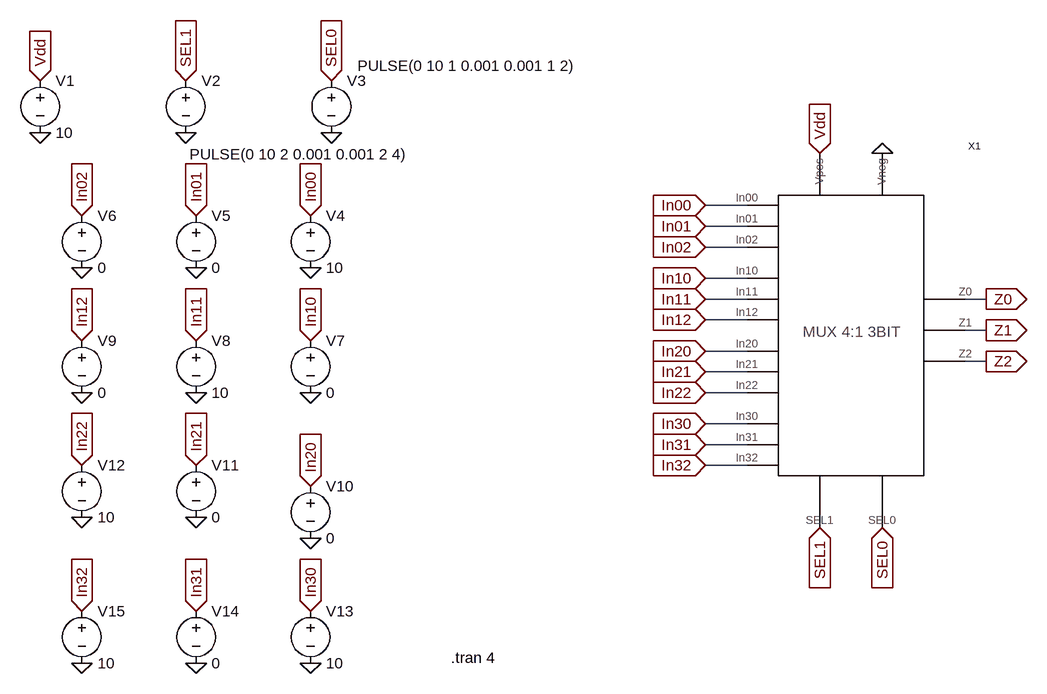
[diagram p0: schematic MUX3BIT_SYM_TESTING.asc]
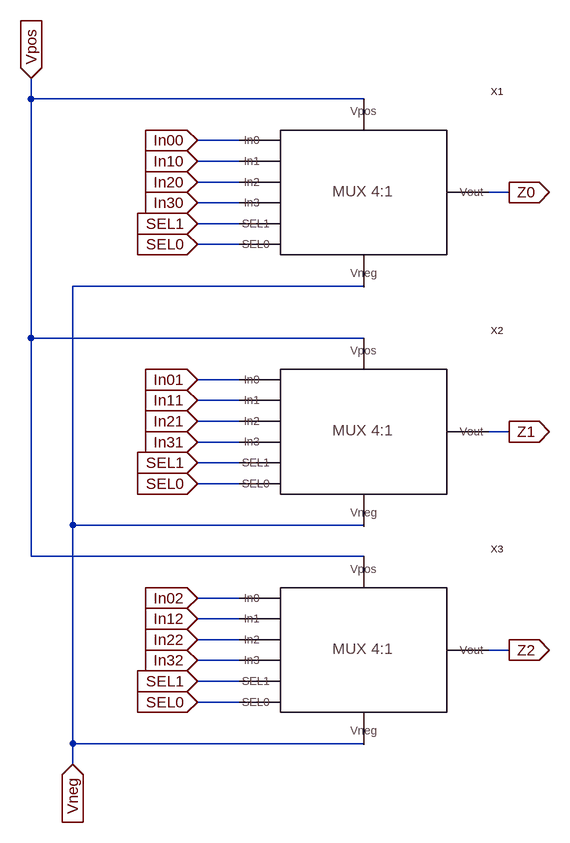
[diagram p1: sub-circuit mux3bit_sym.asc]
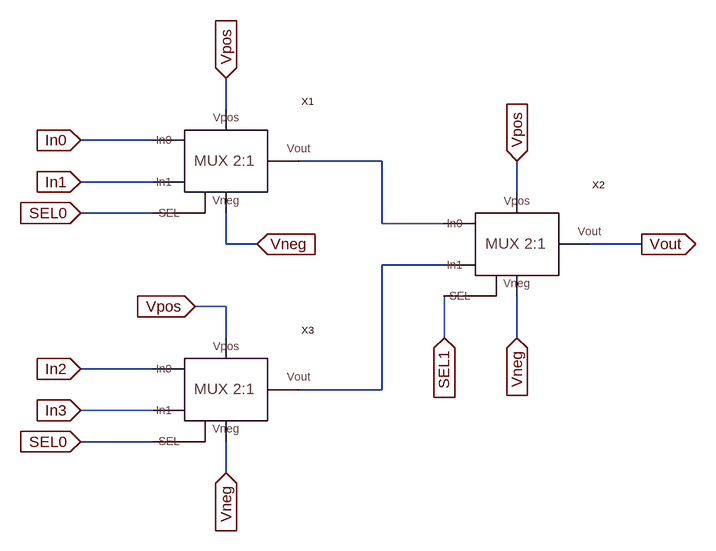
[diagram p2: sub-circuit mux4_1_sym.asc]
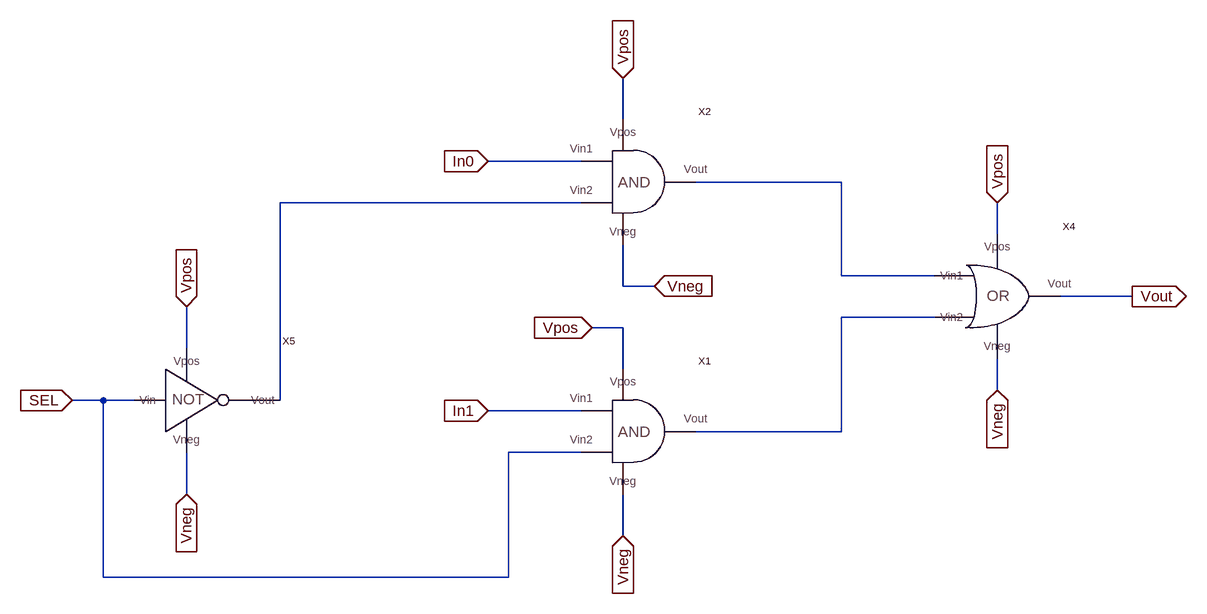
[diagram p3: sub-circuit mux2_1.asc]
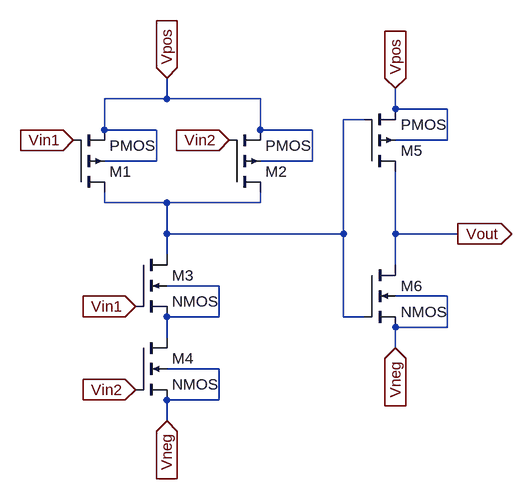
[diagram p4: sub-circuit and_sym.asc]
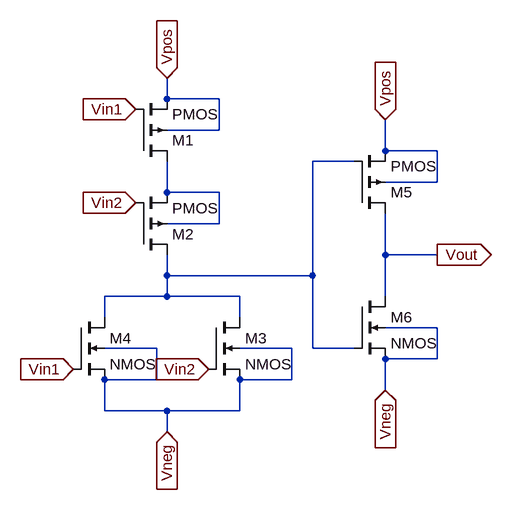
[diagram p5: sub-circuit or_sym.asc]
MUX3BIT_SYM_TESTING.asc, the LTspice schematic file:
Version 4
SHEET 1 1112 824
WIRE 656 64 592 64
WIRE 656 96 592 96
WIRE 656 128 592 128
WIRE 656 176 592 176
WIRE 656 208 592 208
WIRE 1024 208 992 208
WIRE 656 240 592 240
WIRE 1024 256 992 256
WIRE 656 288 592 288
WIRE 1024 304 992 304
WIRE 656 320 592 320
WIRE 656 352 592 352
WIRE 656 400 592 400
WIRE 656 432 592 432
WIRE 656 464 592 464
FLAG -432 -48 0
FLAG -208 -48 0
FLAG 16 -48 0
FLAG -16 160 0
FLAG -192 160 0
FLAG -368 160 0
FLAG -16 352 0
FLAG -192 352 0
FLAG -368 352 0
FLAG -16 576 0
FLAG -192 544 0
FLAG -368 544 0
FLAG -16 768 0
FLAG -192 768 0
FLAG -368 768 0
FLAG -432 -128 Vdd
IOPIN -432 -128 In
FLAG -208 -128 SEL1
IOPIN -208 -128 In
FLAG 16 -128 SEL0
IOPIN 16 -128 In
FLAG -16 80 In00
IOPIN -16 80 In
FLAG -192 80 In01
IOPIN -192 80 In
FLAG -368 80 In02
IOPIN -368 80 In
FLAG -16 272 In10
IOPIN -16 272 In
FLAG -192 272 In11
IOPIN -192 272 In
FLAG -368 272 In12
IOPIN -368 272 In
FLAG -16 496 In20
IOPIN -16 496 In
FLAG -192 464 In21
IOPIN -192 464 In
FLAG -368 464 In22
IOPIN -368 464 In
FLAG -16 688 In30
IOPIN -16 688 In
FLAG -192 688 In31
IOPIN -192 688 In
FLAG -368 688 In32
IOPIN -368 688 In
FLAG 768 -16 Vdd
IOPIN 768 -16 In
FLAG 864 -16 0
FLAG 768 560 SEL1
IOPIN 768 560 In
FLAG 864 560 SEL0
IOPIN 864 560 In
FLAG 592 64 In00
IOPIN 592 64 In
FLAG 592 96 In01
IOPIN 592 96 In
FLAG 592 128 In02
IOPIN 592 128 In
FLAG 592 176 In10
IOPIN 592 176 In
FLAG 592 208 In11
IOPIN 592 208 In
FLAG 592 240 In12
IOPIN 592 240 In
FLAG 592 288 In20
IOPIN 592 288 In
FLAG 592 320 In21
IOPIN 592 320 In
FLAG 592 352 In22
IOPIN 592 352 In
FLAG 592 400 In30
IOPIN 592 400 In
FLAG 592 432 In31
IOPIN 592 432 In
FLAG 592 464 In32
IOPIN 592 464 In
FLAG 1024 208 Z0
IOPIN 1024 208 Out
FLAG 1024 256 Z1
IOPIN 1024 256 Out
FLAG 1024 304 Z2
IOPIN 1024 304 Out
SYMBOL voltage -432 -144 R0
WINDOW 123 0 0 Left 0
WINDOW 39 0 0 Left 0
SYMATTR InstName V1
SYMATTR Value 10
SYMBOL voltage -208 -144 R0
WINDOW 3 6 129 Left 2
WINDOW 123 0 0 Left 0
WINDOW 39 0 0 Left 0
SYMATTR Value PULSE(0 10 2 0.001 0.001 2 4)
SYMATTR InstName V2
SYMBOL voltage -16 64 R0
WINDOW 123 0 0 Left 0
WINDOW 39 0 0 Left 0
SYMATTR InstName V4
SYMATTR Value 10
SYMBOL voltage -192 64 R0
WINDOW 123 0 0 Left 0
WINDOW 39 0 0 Left 0
SYMATTR InstName V5
SYMATTR Value 0
SYMBOL voltage -368 64 R0
WINDOW 123 0 0 Left 0
WINDOW 39 0 0 Left 0
SYMATTR InstName V6
SYMATTR Value 0
SYMBOL voltage -16 256 R0
WINDOW 123 0 0 Left 0
WINDOW 39 0 0 Left 0
SYMATTR InstName V7
SYMATTR Value 0
SYMBOL voltage -192 256 R0
WINDOW 123 0 0 Left 0
WINDOW 39 0 0 Left 0
SYMATTR InstName V8
SYMATTR Value 10
SYMBOL voltage -368 256 R0
WINDOW 123 0 0 Left 0
WINDOW 39 0 0 Left 0
SYMATTR InstName V9
SYMATTR Value 0
SYMBOL voltage -16 480 R0
WINDOW 123 0 0 Left 0
WINDOW 39 0 0 Left 0
SYMATTR InstName V10
SYMATTR Value 0
SYMBOL voltage -192 448 R0
WINDOW 123 0 0 Left 0
WINDOW 39 0 0 Left 0
SYMATTR InstName V11
SYMATTR Value 0
SYMBOL voltage -368 448 R0
WINDOW 123 0 0 Left 0
WINDOW 39 0 0 Left 0
SYMATTR InstName V12
SYMATTR Value 10
SYMBOL voltage -16 672 R0
WINDOW 123 0 0 Left 0
WINDOW 39 0 0 Left 0
SYMATTR InstName V13
SYMATTR Value 10
SYMBOL voltage -192 672 R0
WINDOW 123 0 0 Left 0
WINDOW 39 0 0 Left 0
SYMATTR InstName V14
SYMATTR Value 0
SYMBOL voltage -368 672 R0
WINDOW 123 0 0 Left 0
WINDOW 39 0 0 Left 0
SYMATTR InstName V15
SYMATTR Value 10
SYMBOL MUX3BIT_SYM 816 176 R0
SYMATTR InstName X1
SYMBOL voltage 16 -144 R0
WINDOW 3 40 -7 Left 2
WINDOW 123 0 0 Left 0
WINDOW 39 0 0 Left 0
SYMATTR Value PULSE(0 10 1 0.001 0.001 1 2)
SYMATTR InstName V3
TEXT 200 760 Left 2 !.tran 4

mux3bit_sym.asc, the sub-circuit schematic file:
Version 4
SHEET 1 880 1012
WIRE -256 -128 -256 -160
WIRE 256 -128 -256 -128
WIRE 64 -64 0 -64
WIRE 64 -32 0 -32
WIRE 64 0 0 0
WIRE 480 16 448 16
WIRE 64 32 0 32
WIRE 64 64 0 64
WIRE 64 96 0 96
WIRE 256 160 -192 160
WIRE -256 240 -256 -128
WIRE 256 240 -256 240
WIRE 64 304 0 304
WIRE 64 336 0 336
WIRE 64 368 0 368
WIRE 480 384 448 384
WIRE 64 400 0 400
WIRE 64 432 0 432
WIRE 64 464 0 464
WIRE -192 528 -192 160
WIRE 256 528 -192 528
WIRE -256 576 -256 240
WIRE 256 576 -256 576
WIRE 64 640 0 640
WIRE 64 672 0 672
WIRE 64 704 0 704
WIRE 480 720 448 720
WIRE 64 736 0 736
WIRE 64 768 0 768
WIRE 64 800 0 800
WIRE -192 864 -192 528
WIRE 256 864 -192 864
WIRE -192 896 -192 864
FLAG 0 -64 In00
IOPIN 0 -64 In
FLAG 0 -32 In10
IOPIN 0 -32 In
FLAG 0 0 In20
IOPIN 0 0 In
FLAG 0 32 In30
IOPIN 0 32 In
FLAG 0 64 SEL1
IOPIN 0 64 In
FLAG 0 96 SEL0
IOPIN 0 96 In
FLAG 0 304 In01
IOPIN 0 304 In
FLAG 0 336 In11
IOPIN 0 336 In
FLAG 0 368 In21
IOPIN 0 368 In
FLAG 0 400 In31
IOPIN 0 400 In
FLAG 0 432 SEL1
IOPIN 0 432 In
FLAG 0 464 SEL0
IOPIN 0 464 In
FLAG 0 640 In02
IOPIN 0 640 In
FLAG 0 672 In12
IOPIN 0 672 In
FLAG 0 704 In22
IOPIN 0 704 In
FLAG 0 736 In32
IOPIN 0 736 In
FLAG 0 768 SEL1
IOPIN 0 768 In
FLAG 0 800 SEL0
IOPIN 0 800 In
FLAG -256 -160 Vpos
IOPIN -256 -160 In
FLAG 480 16 Z0
IOPIN 480 16 Out
FLAG 480 384 Z1
IOPIN 480 384 Out
FLAG 480 720 Z2
IOPIN 480 720 Out
FLAG -192 896 Vneg
IOPIN -192 896 In
SYMBOL MUX4_1_SYM 256 16 R0
SYMATTR InstName X1
SYMBOL MUX4_1_SYM 256 384 R0
SYMATTR InstName X2
SYMBOL MUX4_1_SYM 256 720 R0
SYMATTR InstName X3

mux4_1_sym.asc, the sub-circuit schematic file:
Version 4
SHEET 1 880 680
WIRE 16 -112 16 -160
WIRE -96 -64 -208 -64
WIRE 256 -32 128 -32
WIRE -96 0 -208 0
WIRE 464 16 464 -32
WIRE -96 48 -208 48
WIRE 256 64 256 -32
WIRE 352 64 256 64
WIRE 16 96 16 48
WIRE 64 96 16 96
WIRE 656 96 576 96
WIRE 352 128 256 128
WIRE 16 192 -32 192
WIRE 16 240 16 192
WIRE 352 240 352 176
WIRE 464 240 464 176
WIRE -96 288 -208 288
WIRE 256 320 256 128
WIRE 256 320 128 320
WIRE -96 352 -208 352
WIRE -96 400 -208 400
WIRE 16 448 16 400
FLAG 16 -160 Vpos
IOPIN 16 -160 In
FLAG -32 192 Vpos
IOPIN -32 192 In
FLAG 464 -32 Vpos
IOPIN 464 -32 In
FLAG -208 -64 In0
IOPIN -208 -64 In
FLAG -208 0 In1
IOPIN -208 0 In
FLAG -208 288 In2
IOPIN -208 288 In
FLAG -208 352 In3
IOPIN -208 352 In
FLAG 352 240 SEL1
IOPIN 352 240 In
FLAG -208 48 SEL0
IOPIN -208 48 In
FLAG 656 96 Vout
IOPIN 656 96 Out
FLAG -208 400 SEL0
IOPIN -208 400 In
FLAG 464 240 Vneg
IOPIN 464 240 In
FLAG 16 448 Vneg
IOPIN 16 448 In
FLAG 64 96 Vneg
IOPIN 64 96 In
SYMBOL MUX2_1 16 -32 R0
SYMATTR InstName X1
SYMBOL MUX2_1 464 96 R0
SYMATTR InstName X2
SYMBOL MUX2_1 16 320 R0
SYMATTR InstName X3

mux2_1.asc, the sub-circuit schematic file:
Version 4
SHEET 1 1072 680
WIRE 176 -352 176 -416
WIRE 112 -288 -32 -288
WIRE 512 -256 288 -256
WIRE 112 -224 -352 -224
WIRE 752 -176 752 -224
WIRE 512 -112 512 -256
WIRE 656 -112 512 -112
WIRE 176 -96 176 -160
WIRE 224 -96 176 -96
WIRE 960 -80 848 -80
WIRE 656 -48 512 -48
WIRE 176 -32 128 -32
WIRE -496 0 -496 -64
WIRE 176 32 176 -32
WIRE 752 64 752 16
WIRE -624 80 -672 80
WIRE -576 80 -624 80
WIRE -352 80 -352 -224
WIRE 112 96 -32 96
WIRE 512 128 512 -48
WIRE 512 128 288 128
WIRE 112 160 0 160
WIRE -496 224 -496 160
WIRE 176 288 176 224
WIRE -624 352 -624 80
WIRE 0 352 0 160
WIRE 0 352 -624 352
FLAG -32 -288 In0
IOPIN -32 -288 In
FLAG -32 96 In1
IOPIN -32 96 In
FLAG -672 80 SEL
IOPIN -672 80 In
FLAG 176 -416 Vpos
IOPIN 176 -416 In
FLAG 224 -96 Vneg
IOPIN 224 -96 In
FLAG 128 -32 Vpos
IOPIN 128 -32 In
FLAG 752 -224 Vpos
IOPIN 752 -224 In
FLAG 752 64 Vneg
IOPIN 752 64 In
FLAG 176 288 Vneg
IOPIN 176 288 In
FLAG -496 -64 Vpos
IOPIN -496 -64 In
FLAG -496 224 Vneg
IOPIN -496 224 In
FLAG 960 -80 Vout
IOPIN 960 -80 Out
SYMBOL AND_SYM 192 128 R0
SYMATTR InstName X1
SYMBOL AND_SYM 192 -256 R0
SYMATTR InstName X2
SYMBOL OR_SYM 768 -80 R0
SYMATTR InstName X4
SYMBOL NOT_SYM -496 80 R0
SYMATTR InstName X5

and_sym.asc, the sub-circuit schematic file:
Version 4
SHEET 1 880 680
WIRE 272 -16 272 -48
WIRE 272 -16 176 -16
WIRE 416 -16 272 -16
WIRE 624 0 624 -32
WIRE 704 0 624 0
WIRE 576 16 544 16
WIRE 176 32 176 -16
WIRE 256 32 176 32
WIRE 416 32 416 -16
WIRE 496 32 416 32
WIRE 704 48 704 0
WIRE 704 48 624 48
WIRE 256 80 256 32
WIRE 256 80 176 80
WIRE 496 80 496 32
WIRE 496 80 416 80
WIRE 176 144 176 128
WIRE 272 144 176 144
WIRE 416 144 416 128
WIRE 416 144 272 144
WIRE 272 192 272 144
WIRE 544 192 544 16
WIRE 544 192 272 192
WIRE 624 192 624 96
WIRE 720 192 624 192
WIRE 272 224 272 192
WIRE 624 240 624 192
WIRE 352 272 272 272
WIRE 704 288 624 288
WIRE 352 320 352 272
WIRE 352 320 272 320
WIRE 544 320 544 192
WIRE 576 320 544 320
WIRE 704 336 704 288
WIRE 704 336 624 336
WIRE 272 352 272 320
WIRE 624 368 624 336
WIRE 352 400 272 400
WIRE 352 448 352 400
WIRE 352 448 272 448
WIRE 272 480 272 448
FLAG 272 -48 Vpos
IOPIN 272 -48 In
FLAG 128 48 Vin1
IOPIN 128 48 In
FLAG 224 304 Vin1
IOPIN 224 304 In
FLAG 224 432 Vin2
IOPIN 224 432 In
FLAG 720 192 Vout
IOPIN 720 192 Out
FLAG 368 48 Vin2
IOPIN 368 48 In
FLAG 272 480 Vneg
IOPIN 272 480 In
FLAG 624 -32 Vpos
IOPIN 624 -32 In
FLAG 624 368 Vneg
IOPIN 624 368 In
SYMBOL pmos4 128 128 M180
SYMATTR InstName M1
SYMBOL pmos4 368 128 M180
SYMATTR InstName M2
SYMBOL nmos4 224 224 R0
SYMATTR InstName M3
SYMBOL nmos4 224 352 R0
SYMATTR InstName M4
SYMBOL pmos4 576 96 M180
SYMATTR InstName M5
SYMBOL nmos4 576 240 R0
SYMATTR InstName M6

or_sym.asc, the sub-circuit schematic file:
Version 4
SHEET 1 880 680
WIRE 128 -128 128 -160
WIRE 208 -128 128 -128
WIRE 208 -80 208 -128
WIRE 208 -80 128 -80
WIRE 464 -48 464 -96
WIRE 544 -48 464 -48
WIRE 416 -32 352 -32
WIRE 544 0 544 -48
WIRE 544 0 464 0
WIRE 128 16 128 -32
WIRE 208 16 128 16
WIRE 208 64 208 16
WIRE 208 64 128 64
WIRE 464 112 464 48
WIRE 544 112 464 112
WIRE 128 144 128 112
WIRE 352 144 352 -32
WIRE 352 144 128 144
WIRE 128 176 128 144
WIRE 128 176 32 176
WIRE 240 176 128 176
WIRE 464 176 464 112
WIRE 32 208 32 176
WIRE 240 208 240 176
WIRE 544 224 464 224
WIRE 112 256 32 256
WIRE 320 256 240 256
WIRE 352 256 352 144
WIRE 416 256 352 256
WIRE 544 272 544 224
WIRE 544 272 464 272
WIRE 112 304 112 256
WIRE 112 304 32 304
WIRE 320 304 320 256
WIRE 320 304 240 304
WIRE 464 320 464 272
WIRE 32 352 32 304
WIRE 128 352 32 352
WIRE 240 352 240 304
WIRE 240 352 128 352
WIRE 128 384 128 352
FLAG 128 -160 Vpos
IOPIN 128 -160 In
FLAG 128 384 Vneg
IOPIN 128 384 In
FLAG -16 288 Vin1
IOPIN -16 288 In
FLAG 192 288 Vin2
IOPIN 192 288 In
FLAG 80 -112 Vin1
IOPIN 80 -112 In
FLAG 80 32 Vin2
IOPIN 80 32 In
FLAG 544 112 Vout
IOPIN 544 112 Out
FLAG 464 -96 Vpos
IOPIN 464 -96 In
FLAG 464 320 Vneg
IOPIN 464 320 In
SYMBOL pmos4 80 -32 M180
SYMATTR InstName M1
SYMBOL pmos4 80 112 M180
SYMATTR InstName M2
SYMBOL nmos4 192 208 R0
SYMATTR InstName M3
SYMBOL nmos4 -16 208 R0
SYMATTR InstName M4
SYMBOL pmos4 416 48 M180
SYMATTR InstName M5
SYMBOL nmos4 416 176 R0
SYMATTR InstName M6

The netlist it stands for:
* MUX3BIT_SYM_TESTING.asc
V1 Vdd 0 10
V2 SEL1 0 PULSE(0 10 2 0.001 0.001 2 4)
V4 In00 0 10
V5 In01 0 0
V6 In02 0 0
V7 In10 0 0
V8 In11 0 10
V9 In12 0 0
V10 In20 0 0
V11 In21 0 0
V12 In22 0 10
V13 In30 0 10
V14 In31 0 0
V15 In32 0 10
XX1 Vdd 0 In00 In01 In02 In10 In11 In12 In20 In21 In22 In30 In31 In32 Z0 Z1 Z2 SEL0 SEL1 mux3bit_sym
V3 SEL0 0 PULSE(0 10 1 0.001 0.001 1 2)

* block symbol definitions
.subckt mux3bit_sym Vpos Vneg In00 In01 In02 In10 In11 In12 In20 In21 In22 In30 In31 In32 Z0 Z1 Z2 SEL0 SEL1
XX1 Z0 Vpos Vneg In00 In10 In20 In30 SEL1 SEL0 mux4_1_sym
XX2 Z1 Vpos Vneg In01 In11 In21 In31 SEL1 SEL0 mux4_1_sym
XX3 Z2 Vpos Vneg In02 In12 In22 In32 SEL1 SEL0 mux4_1_sym
.ends mux3bit_sym

.subckt mux4_1_sym Vout Vpos Vneg In0 In1 In2 In3 SEL1 SEL0
XX1 In0 In1 SEL0 Vpos Vneg N001 mux2_1
XX2 N001 N002 SEL1 Vpos Vneg Vout mux2_1
XX3 In2 In3 SEL0 Vpos Vneg N002 mux2_1
.ends mux4_1_sym

.subckt mux2_1 In0 In1 SEL Vpos Vneg Vout
XX1 In1 SEL Vpos Vneg N003 and_sym
XX2 In0 N002 Vpos Vneg N001 and_sym
XX4 Vpos N001 N003 Vout Vneg or_sym
XX5 SEL Vpos N002 Vneg NOT_SYM  ; pins Vin Vpos Vout Vneg
.ends mux2_1

.subckt and_sym Vin1 Vin2 Vpos Vneg Vout
M1 N001 Vin1 Vpos Vpos PMOS
M2 N001 Vin2 Vpos Vpos PMOS
M3 N001 Vin1 N002 N002 NMOS
M4 N002 Vin2 Vneg Vneg NMOS
M5 Vout N001 Vpos Vpos PMOS
M6 Vout N001 Vneg Vneg NMOS
.ends and_sym

.subckt or_sym Vpos Vin1 Vin2 Vout Vneg
M1 N002 Vin1 Vpos Vpos PMOS
M2 N001 Vin2 N002 N002 PMOS
M3 N001 Vin2 Vneg Vneg NMOS
M4 N001 Vin1 Vneg Vneg NMOS
M5 Vout N001 Vpos Vpos PMOS
M6 Vout N001 Vneg Vneg NMOS
.ends or_sym

.model NMOS NMOS
.model PMOS PMOS
.lib standard.mos
.tran 4
.backanno
.end

* Results of the author's LTspice run, read from the files saved beside the schematic
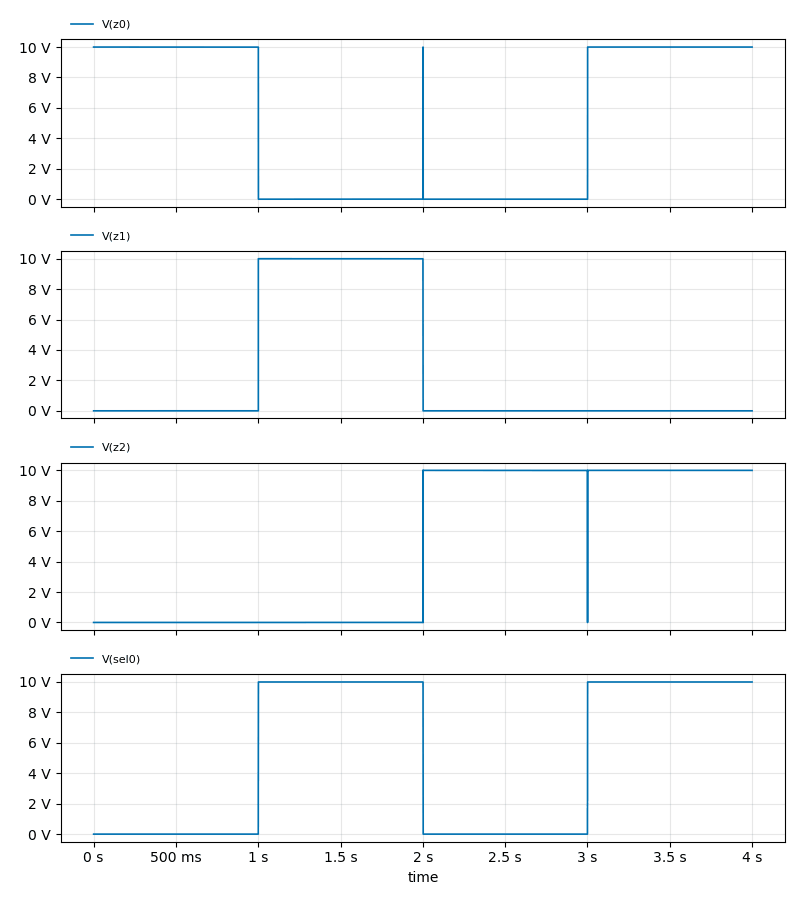
[diagram p6: Transient Analysis of MUX3BIT_SYM_TESTING.asc, plotted from the saved traces]
* Transient Analysis, 1 run:
*   V(z0): min 0 V, max 10 V, average 5.002 V, rms 7.073 V, last 10 V
*   V(z1): min 0 V, max 10 V, average 2.5 V, rms 5 V, last 0 V
*   V(z2): min 0 V, max 10 V, average 4.999 V, rms 7.07 V, last 10 V
*   V(sel0): min 0 V, max 10 V, average 5.001 V, rms 7.071 V, last 10 V